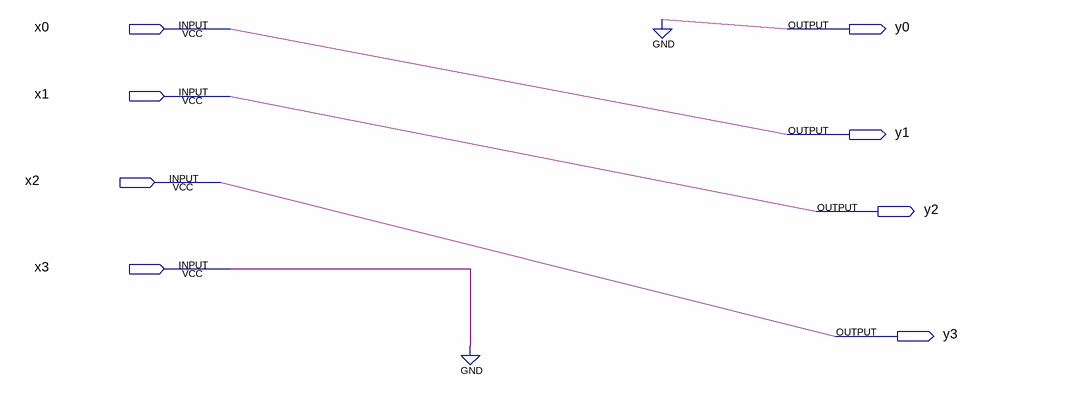
[diagram p0: schematic sheet]
// Quartus schematic multiplicador.bdf as structural Verilog: 0 symbols, 8 pins
module multiplicador (
  input  x0,
  input  x1,
  input  x2,
  input  x3,
  output y0,
  output y1,
  output y2,
  output y3
);


  assign y0 = 1'b0;
  assign y1 = x0;
  assign y2 = x1;
  assign y3 = x2;
  // also tied to GND on the sheet: x3
endmodule
